# EAGLE design usb-dip-switch (EAGLE 7.7.0)
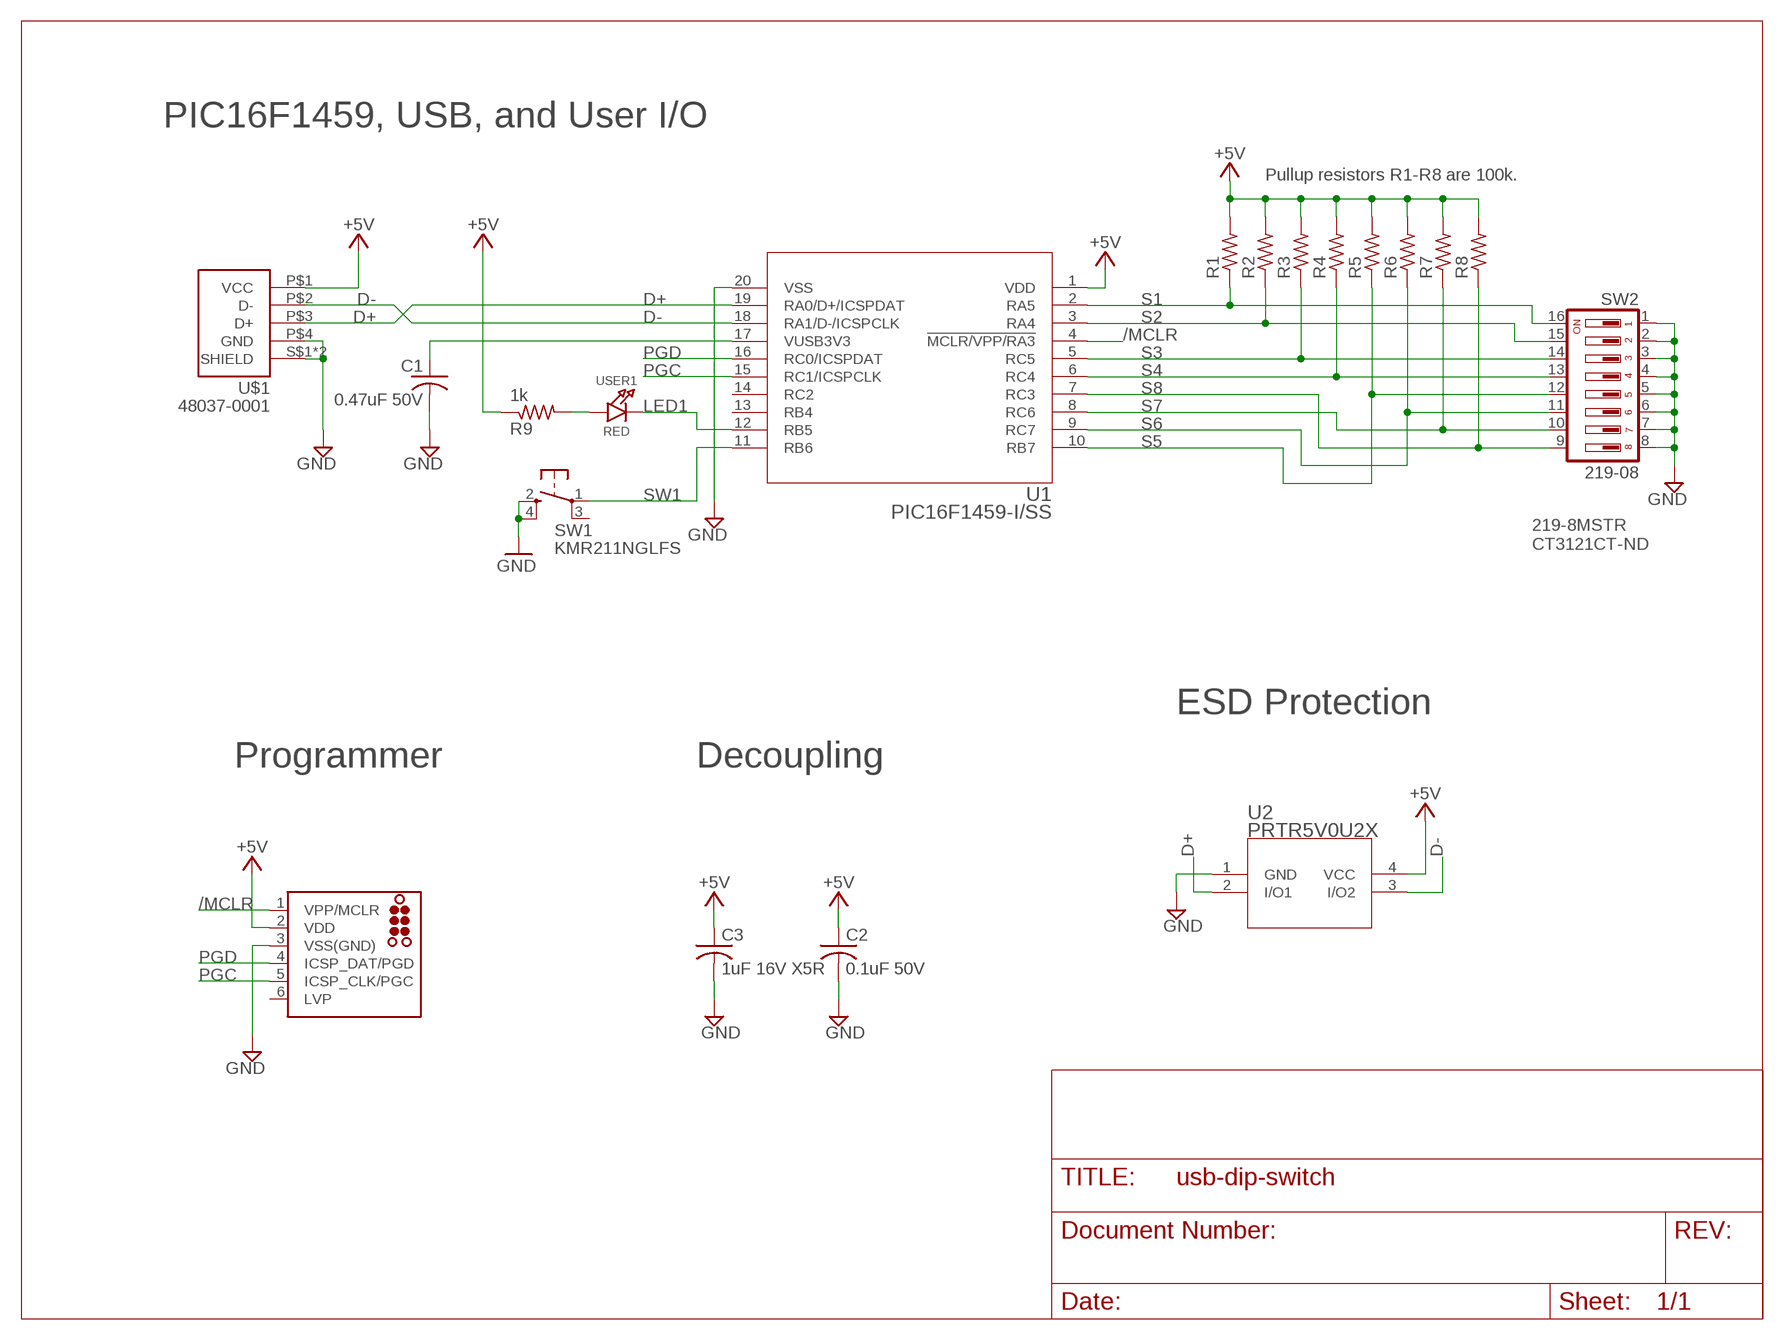
[diagram p0: schematic, sheet 1]

## Parts
C1  0.47uF 50V  C-USC1206K  [C1206K]
C2  0.1uF 50V  C-USC0603  [C0603]
C3  1uF 16V X5R  C-USC0603  [C0603]
J3  TC2030-MCP-NL  [TC2030-MCP-NL]
R1  100k  R-US_R0603  [R0603]
R2  100k  R-US_R0603  [R0603]
R3  100k  R-US_R0603  [R0603]
R4  100k  R-US_R0603  [R0603]
R5  100k  R-US_R0603  [R0603]
R6  100k  R-US_R0603  [R0603]
R7  100k  R-US_R0603  [R0603]
R8  100k  R-US_R0603  [R0603]
R9  1k  R-US_R0805  [R0805]
SW1  KMR211NGLFS  SPST_TACT-KMR2  [KMR2]
SW2  219-08  [CTS-219-08]
U1  PIC16F1459-I/SS  [SSOP20_MC]
U2  PRTR5V0U2X  [SOT143B]
U$1  48037-0001  [48037-0001]
USER1  RED  LED0805_NOOUTLINE  [CHIPLED_0805_NOOUTLINE]

## Nets
+5V: C2.1 C3.1 J3.2(VDD) R1.2 R2.2 R3.2 R4.2 R5.2 R6.2 R7.2 R8.2 R9.1 U1.1(VDD) U2.4(VCC) U$1.P$1(VCC)
/MCLR: J3.1(VPP/MCLR) U1.4(!MCLR/VPP/RA3)
D+: U1.19(RA0/D+/ICSPDAT) U2.2(I/O1) U$1.P$3(D+)
D-: U1.18(RA1/D-/ICSPCLK) U2.3(I/O2) U$1.P$2(D-)
GND: C1.2 C2.2 C3.2 J3.3(VSS(GND)) SW1.2(S) SW1.4(S1) SW2.1 SW2.2 SW2.3 SW2.4 SW2.5 SW2.6 SW2.7 SW2.8 U1.20(VSS) U2.1(GND) U$1.P$4(GND) U$1.S$1(SHIELD) U$1.S$2(SHIELD)
LED1: U1.12(RB5) USER1.C
N$2: R9.2 USER1.A
PGC: J3.5(ICSP_CLK/PGC) U1.15(RC1/ICSPCLK)
PGD: J3.4(ICSP_DAT/PGD) U1.16(RC0/ICSPDAT)
S1: R1.1 SW2.16 U1.2(RA5)
S2: R2.1 SW2.15 U1.3(RA4)
S3: R3.1 SW2.14 U1.5(RC5)
S4: R4.1 SW2.13 U1.6(RC4)
S5: R5.1 SW2.12 U1.10(RB7)
S6: R6.1 SW2.11 U1.9(RC7)
S7: R7.1 SW2.10 U1.8(RC6)
S8: R8.1 SW2.9 U1.7(RC3)
SW1: SW1.1(P) U1.11(RB6)
VUSB1: C1.1 U1.17(VUSB3V3)
Unconnected: J3.6(LVP) SW1.3(P1) U1.13(RB4) U1.14(RC2)

## Notes on the sheet
- PIC16F1459, USB, and User I/O
- Pullup resistors R1-R8 are 100k.
- 219-8MSTR
  CT3121CT-ND
- ESD Protection
- Programmer | Decoupling

## Library data of the parts
C1 = rcl:C-US: CAPACITOR, American symbol; MFR: KEMET; MFR_PART_NO: C1206C474K5RACTU
C2 = rcl:C-US: CAPACITOR, American symbol; MFR: KEMET; MFR_PART_NO: C1206S104M5RACTU
C3 = rcl:C-US: CAPACITOR, American symbol; MFR: KEMET; MFR_PART_NO: C1210C105K4PACTU
J3 = tag-connect:TC2030: TAG-CONNECT ICSP Connector Manufacturer: Tag-Connect <http://www.tag-connect.com> Cable for easy In-Circuit Serial Programming. Designed for Microchip ICD2, suitable for many others. Two variants - one "with legs" (for hands-free fit on PCB) and another "without legs" for quick programming. PAD Description 1 MCLR/Vpp 2 Vdd 3 GND 4 PGD (ISPDAT) 5 PGC (ISPCLK) 6 nc (used for LVP) ©2009 ROFA.cz - modified and updated by Robert Darlington ‹rdarlington@gmail.com›
R1-R9 = rcl:R-US_: RESISTOR, American symbol
SW1 = adafruit:SPST_TACT: SMT 6mm switch, EVQQ2 series http://www.ladyada.net/library/eagle
SW2 = switch-dil:219-08*: Surface Mount DIP Switch Series 219 SMT CTS Electronic Components Sourc: www.ctscorp.com; OC_FARNELL: unknown; OC_NEWARK: unknown
U1 = pic16f1459-i-ss:PIC16F1459-I/SS; MANUFACTURER_PART_NUMBER: PIC16F1459ISS; VENDOR: Microchip
U2 = Nexperia_PRTR5V0U2X,215:PRTR5V0U2X; MANUFACTURER_PART_NUMBER: PRTR5V0U2X; VENDOR: NXP
U$1 = Glen-MolexUSB:48037-0001
USER1 = microbuilder:LED: LED 0603 - 0603 Surface Mount Package 2mA: Green LED - Low Power (3.9mcd, 2ma, 1.7Vf) - Digikey: 475-2709-2-ND Orange LED - Low Power (9.8mcd, 2ma, 1.8Vf) - Digikey: 475-1194-2-ND Red LED - Low Power (5mcd, 2ma, 1.8Vf) - Digikey: 475-1195-2-ND Yellow LED - Low Power (7mcd, 2ma, 1.8Vf) - Digikey: 475-1196-2-ND 5mA: Blue LED - Low Power (17mcd, 5ma, 2.9Vf) - Digikey: LNJ937W8CRACT-ND 0805 - 0805 Surface Mount Package 2mA: Red LED (8.8mcd, 2mA, 1.8Vf, Clear) - Low Power [Digikey: 475-2510-1-ND] Green LED (5mcd, 2mA, 1.8Vf, Clear) - Low Power [Digikey: 475-2730-1-ND] Yellow LED (11.3mcd, 2mA, 1.8Vf, Clear) - Low Power [Digikey: 475-2555-1-ND] 20mA: Red LED (104mcd, 20mA, Diffused) - LS R976 [Digikey: 475-1278-6-ND] Red LED (12mcd, 20mA, 2.0Vf, Clear) - APT2012EC [Digikey: 754-1128-1-ND] Green LED (15mcd, 20mA, 2.2Vf, Clear) - APT2012GC [Digikey: 754-1131-1-ND] Orange LED (160mcd, 20mA, 2.1Vf, Clear) - APT2012SECK [Digikey: 754-1130-1-ND] 1206 - 1206 Surface Mount Package Green LED (26mcd, 20mA, Diffused) - LG N971 [Digikey: 475-1407-6-ND] Red LED (15mcd, 20mA, Diffused) - LH N974 [Digikey: 475-1416-6-ND] Cree - Cree High-Power Surface Mount LEDs XPEBWT-L1-0000-00D50 - White 111lm 350mA 2.9Vf 6200K 110° XTEAWT-00-0000-00000LEE3 - White 114lm 350mA 2.85Vf 5000K 115° Everlight - Everlight 45-21 Series Surface Mount LEDs 45-21/QK2C-B2832AC2CB2/2T - Warm White 2000mcd 20mA 3.25Vf 3050K 120° 45-21/LK2C-B38452C4CB2/2T - Nuetral White 2000mcd 20mA 3.25Vf 4150K 120° 45-21/LK2C-B50634C6CB2/2T - Cold White 2200mcd 20mA 3.25Vf 5650K 120° PLCC2 Reverse Mount LS T77K-J1L2-1-0-2-R18-Z - Red 11.25mcd 2mA 1.8Vf 630nm 120° LO T77K-L1M2-24-Z - Orange 19.6mcd 2mA 1.8Vf 606nm 120° LY T77K-K2M1-26-Z - Yellow 15.7mcd 2mA 1.8Vf 587nm 120°

## Board
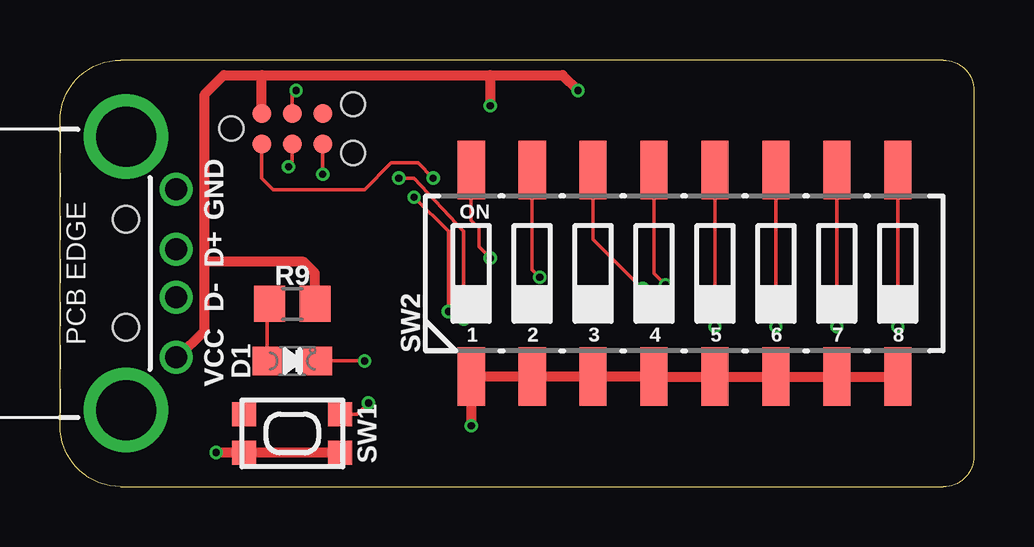
[diagram p1: board, top side]
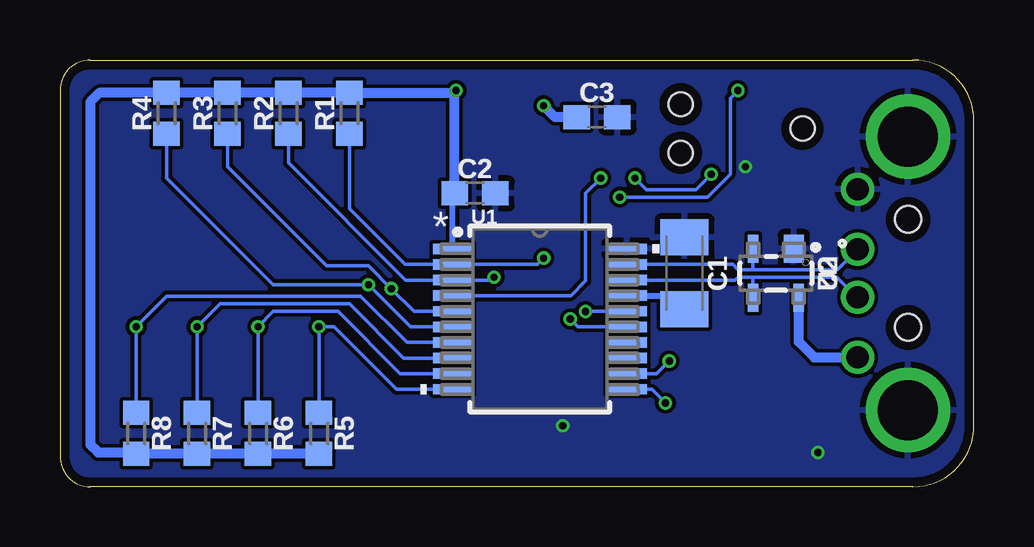
[diagram p2: board, bottom side, seen from below]

Size 38.1 x 17.78 mm. Coordinates in mm from the lower left corner, seen from the top.
Outline: 2.54,0 36.83,0 arc90 38.1,1.27 38.1,16.51 arc90 36.83,17.78 2.54,17.78 arc90 0,15.24 0,2.54 arc90 2.54,0
Copper layers (1*16): Top 0.035559375mm / dielectric 1.6mm / Bottom 0.035559375mm
Design rules "oshpark-2layer-2018": minimum track width 6mil, minimum drill 10mil, track to track 6mil, track to pad 6mil, pad to pad 6mil, via to via 6mil, smd to smd 6mil, copper to edge 15mil, drill to drill 6mil, minimum pad ring 5mil, minimum via ring 5mil, stop-mask expansion 2.5mil, vias tented up to drill 0mil, thermal gap 10mil

### Footprints (pad centres in the part's own frame; a part is rotated, then mirrored left to right if it is on the bottom)
C1206K = smd 1.5 x 2: 1 -1.5,0; 2 1.5,0
C0603 = smd 1.1 x 1: 1 -0.85,0; 2 0.85,0
TC2030-MCP-NL = smd 0.787 x 0.787: 1 1.27,-0.635; 2 1.27,0.635; 3 2.54,-0.635; 4 2.54,0.635; 5 3.81,-0.635; 6 3.81,0.635 | hole 0.991: 0,0; 5.08,-1.016; 5.08,1.016
R0603 = smd 1 x 1.1: 1 -0.85,0; 2 0.85,0
R0805 = smd 1.3 x 1.5: 1 -0.95,0; 2 0.95,0
KMR2 = smd 1 x 1: 1 2,0.8; 2 2,-0.8; 3 -2,0.8; 4 -2,-0.8
CTS-219-08 = smd 1.13 x 2.44: 1 -8.89,-4.3; 2 -6.35,-4.3; 3 -3.81,-4.3; 4 -1.27,-4.3; 5 1.27,-4.3; 6 3.81,-4.3; 7 6.35,-4.3; 8 8.89,-4.3; 9 8.89,4.3; 10 6.35,4.3; 11 3.81,4.3; 12 1.27,4.3; 13 -1.27,4.3; 14 -3.81,4.3; 15 -6.35,4.3; 16 -8.89,4.3
SSOP20_MC = smd 1.651 x 0.432: 1 -3.632,2.925; 2 -3.632,2.275; 3 -3.632,1.625; 4 -3.632,0.975; 5 -3.632,0.325; 6 -3.632,-0.325; 7 -3.632,-0.975; 8 -3.632,-1.625; 9 -3.632,-2.275; 10 -3.632,-2.925; 11 3.632,-2.925; 12 3.632,-2.275; 13 3.632,-1.625; 14 3.632,-0.975; 15 3.632,-0.325; 16 3.632,0.325; 17 3.632,0.975; 18 3.632,1.625; 19 3.632,2.275; 20 3.632,2.925
SOT143B = smd 0.838 x 1.168: 1 -0.747,-1.016 | smd 0.432 x 1.168: 2 0.95,-1.016; 3 0.95,1.016; 4 -0.95,1.016
48037-0001 = drill 0.92: P$1 3.5,4.85; P$2 1,4.85; P$3 -1,4.85; P$4 -3.5,4.85 | drill 2.5: S$1 5.7,2.75; S$2 -5.7,2.75 | hole 1.1: 2.25,2.75; -2.25,2.75
CHIPLED_0805_NOOUTLINE = smd 1.2 x 1.2: A 0,-1.05; C 0,1.05

### Placement (x,y rotation side)
C1  12.06,8.89 90 bottom
C2  20.8,12.22 0 bottom
C3  15.72,15.4 0 bottom
J3  7.14,14.92 0 top
R1  26.04,15.56 90 bottom
R2  28.57,15.56 90 bottom
R3  31.11,15.56 90 bottom
R4  33.66,15.56 90 bottom
R5  27.3,2.22 270 bottom
R6  29.84,2.22 270 bottom
R7  32.38,2.22 270 bottom
R8  34.92,2.22 270 bottom
R9  9.68,7.62 180 top
SW1  9.68,2.22 0 top
SW2  26.04,8.89 0 top
U1  18.1,6.99 0 bottom
U2  8.26,8.89 180 bottom
U$1  0,8.89 270 top
USER1  9.68,5.24 270 top

### Tracks (layer width: path | path; a pad name or v marks a point on that pad's centre or on a via)
+5V  (via drill 0.3)
  Top 0.254: U$1.P$1 4.91,5.39
  Top 0.406: 4.91,5.39 6.03,6.51 6.03,9.37 | 6.03,9.37 6.03,16.35 6.83,17.14 8.41,17.14 | 8.41,17.14 17.94,17.14 | 17.94,17.14 20.95,17.14 v21.59,16.51 | R9.1 10.63,8.89 10.16,9.37 6.03,9.37 | J3.2 8.41,17.14 | v17.94,15.88 17.94,17.14
  Bottom 0.152: 34.98,1.43 R8.2 | 21.69,16.41 v21.59,16.51
  Bottom 0.254: U1.1 21.73,12.15 C2.1 | U2.4 | 21.65,16.45 v21.59,16.51
  Bottom 0.406: U2.4 7.3,6.03 6.66,5.39 U$1.P$1 | C2.1 21.65,16.45 | C3.1 17.46,15.4 v17.94,15.88 | R5.2 R6.2 R7.2 R8.2 | 34.98,1.43 36.51,1.43 36.83,1.75 36.83,16.03 36.46,16.41 R4.2 R3.2 R2.2 R1.2 21.69,16.41
/MCLR  (via drill 0.3)
  Top 0.152: J3.1 8.41,12.86 8.89,12.38 12.7,12.38 13.81,13.49 14.92,13.49 v15.56,12.86
  Bottom 0.152: v15.56,12.86 16.19,12.22 16.19,8.57 16.8,7.96 U1.4
D+
  Bottom 0.152: U1.19 10.05,9.26 9.84,9.05 9.21,9.05 | 9.21,9.05 5.69,9.05 U$1.P$3 | U2.2 9.21,9.05
D-
  Bottom 0.152: U1.18 9.96,8.61 9.84,8.73 9.21,8.73 | U$1.P$2 4.87,7.89 5.71,8.73 9.21,8.73 | U2.3 9.21,8.73
GND  (via drill 0.3)
  Top 0.152: J3.3 9.68,13.49 v9.53,13.34 | v6.51,1.42 v6.51,1.43
  Top 0.406: SW1.2 SW1.4 v6.51,1.42 | v17.14,2.54 SW2.1 SW2.2 SW2.3 SW2.4 SW2.5 SW2.6 SW2.7 SW2.8
  pour Bottom (isolate 0.152): 0,17.78 0,0 38.1,0 38.1,17.78
LED1  (via drill 0.3)
  Top 0.152: v12.7,5.24 USER1.C
  Bottom 0.152: U1.12 13.23,4.71 v12.7,5.24
N$2
  Top 0.152: USER1.A 8.63,7.52 R9.2
PGC  (via drill 0.3)
  Top 0.152: v16.83,6.99 16.83,10.64 14.76,12.86 v14.13,12.86 | J3.5 v10.95,13.02
  Bottom 0.152: U1.15 16.5,6.66 v16.83,6.99 | v10.95,13.02 11.59,12.38 13.65,12.38 v14.13,12.86
PGD  (via drill 0.3)
  Top 0.152: v16.19,7.3 16.19,10.64 v14.76,12.06 | J3.4 9.68,16.35 v9.84,16.51
  Bottom 0.152: U1.16 v16.2,7.31 v16.19,7.3 | v9.84,16.51 10.16,16.19 10.16,13.02 11.11,12.06 v14.76,12.06
S1  (via drill 0.3)
  Top 0.152: SW2.16 17.14,11.11 17.46,10.79 17.46,10 v17.94,9.53
  Bottom 0.152: v17.94,9.53 18.2,9.26 U1.2 23.71,9.26 26.04,11.59 R1.1
S2  (via drill 0.3)
  Top 0.152: SW2.15 19.68,9.05 v20,8.73
  Bottom 0.152: v20,8.73 20.12,8.61 U1.3 23.69,8.61 28.57,13.49 R2.1
S3  (via drill 0.3)
  Top 0.152: SW2.14 22.23,10.32 v24.29,8.26
  Bottom 0.152: U1.5 23.34,7.31 v24.29,8.26 25.24,9.21 26.99,9.21 31.11,13.34 R3.1
S4  (via drill 0.3)
  Top 0.152: SW2.13 24.77,8.89 v25.24,8.41
  Bottom 0.152: R4.1 33.66,12.86 29.21,8.41 v25.24,8.41 23.49,6.66 U1.6
S5  (via drill 0.3)
  Top 0.152: SW2.12 v27.3,6.67
  Bottom 0.152: U1.10 24.06,4.06 26.67,6.67 v27.3,6.67 R5.1
S6  (via drill 0.3)
  Top 0.152: SW2.11 v29.84,6.67
  Bottom 0.152: U1.9 23.92,4.71 26.51,7.3 29.21,7.3 v29.84,6.67 R6.1
S7  (via drill 0.3)
  Top 0.152: SW2.10 v32.38,6.67
  Bottom 0.152: U1.8 23.77,5.36 26.04,7.62 31.43,7.62 v32.38,6.67 R7.1
S8  (via drill 0.3)
  Top 0.152: SW2.9 v34.92,6.67
  Bottom 0.152: U1.7 23.63,6.01 25.56,7.94 33.66,7.94 v34.92,6.67 R8.1
SW1  (via drill 0.3)
  Top 0.152: v12.86,3.49 12.38,3.02 SW1.1
  Bottom 0.152: U1.11 13.43,4.06 v12.86,3.49
VUSB1
  Bottom 0.152: 12.63,7.96 C1.1
  Bottom 0.254: U1.17 12.63,7.96

### Text on the board
_tsilk: GND | GND | ON | D+ | D+ | D- | D- | R9 | SW2 | 1 | 2 | 3 | 4 | 5 | 6 | 7 | 8 | VCC | VCC | D1 | SW1
_bsilk: C3 | R1 | R2 | R3 | R4 | C2 | U1 | U2 | C1 | R5 | R6 | R7 | R8